# Altium project ArduinoMegaSheild.PrjPcb
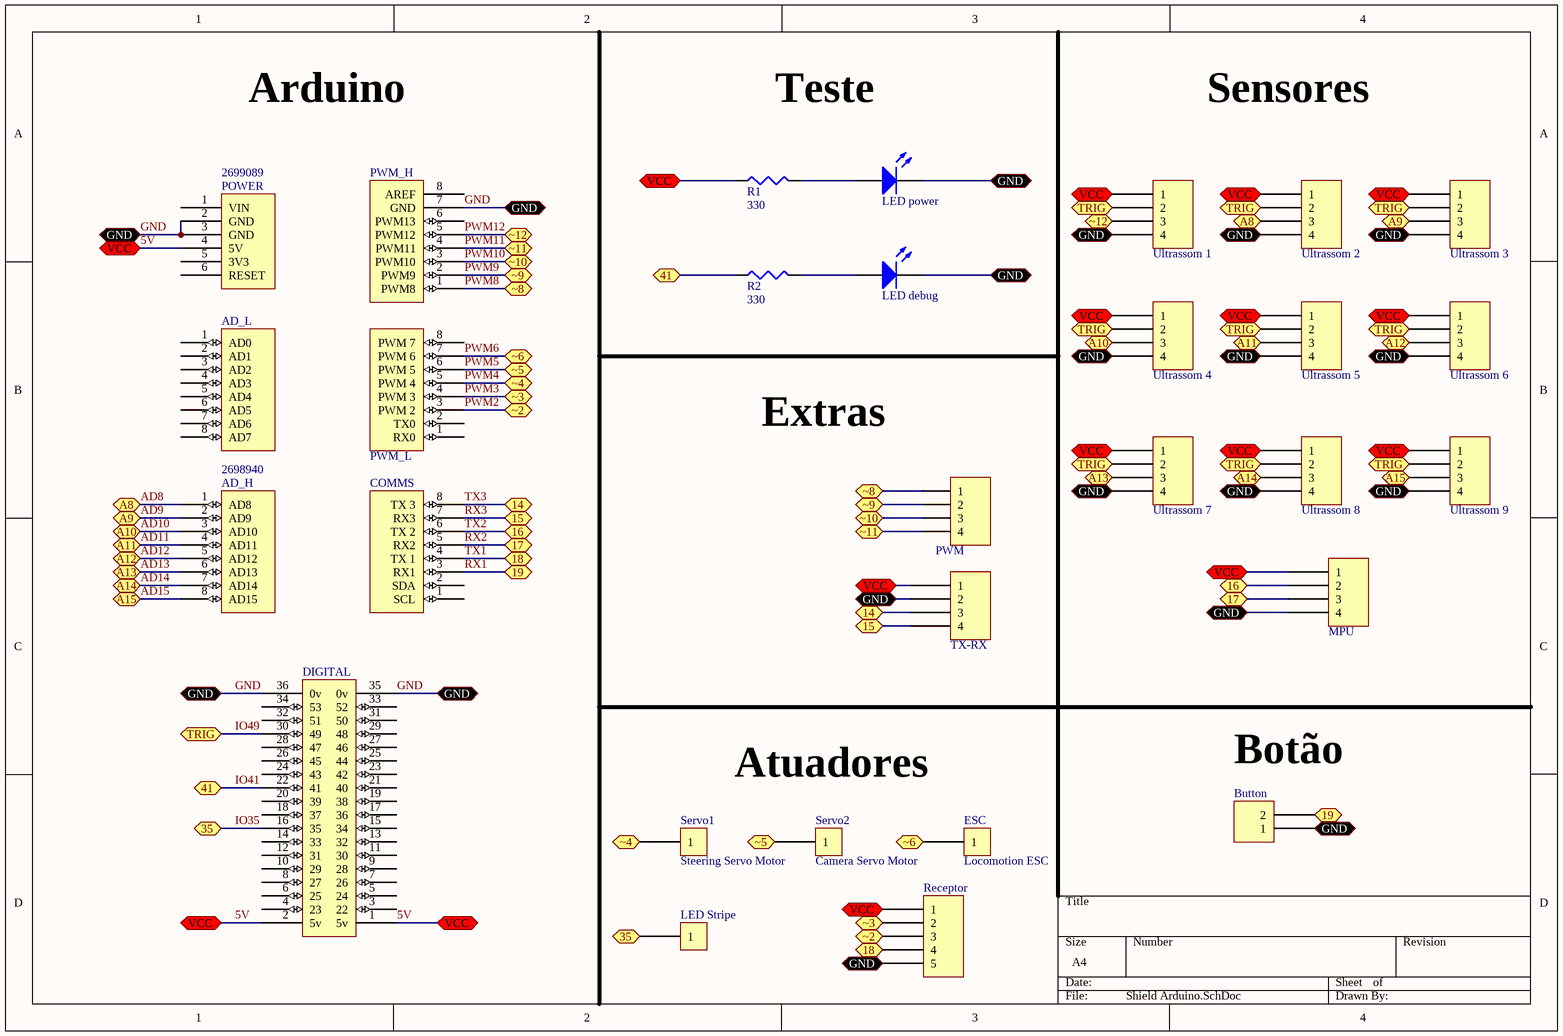
[diagram p0: Shield Arduino.SchDoc]
1 sheet, 29 parts. Net scope: flat (ports and power ports of the same name join across sheets).
Board file: Arduino MEGA blank shield.pcbdoc

## Sheet Shield Arduino.SchDoc
size A4

### Parts
AD_H  Supplier Part Number 4: 2698940  [Header 8x1 8.5mm]  (hidden comment: AD_H)
AD_L  AD_L  [Header 8x1 8.5mm]  (value not drawn)
Button  Botão  [KK2]  (value not drawn)
COMMS  Communication  [Header 8x1 8.5mm]  (value not drawn)
Debug  LED debug  [3.2X1.6X1.1]
DIGITAL  IO_36  [HEADER 36X 8MM]  (value not drawn)
ESC  Locomotion ESC  [HEADER 1X1 8.5MM]
Led1  LED power  [3.2X1.6X1.1]
LED_Stripe  *  [HEADER 1X1 8.5MM]  (value not drawn)
Motores  PWM_L  [Header 8x1 8.5mm]
MPU  MPU  [KK4]
POWER  Supplier Part Number 2: 2699089  [Header 6x1 8.5mm]  (hidden comment: POWER)
PWM  PWM  [HDR1X4]
PWM_H  PWM_H  [Header 8x1 8.5mm]  (value not drawn)
R1  R1  value 330  [J1-0603]
R2  R2  value 330  [J1-0603]
Receptor  *  (value not drawn)
Servo1  Steering Servo Motor  [HEADER 1X1 8.5MM]
Servo2  Camera Servo Motor  [HEADER 1X1 8.5MM]
TX-RX  TX-RX  [KK4]
US1  Ultrassom 1  [KK4]
US2  Ultrassom 2  [KK4]
US3  Ultrassom 3  [KK4]
US4  Ultrassom 4  [KK4]
US5  Ultrassom 5  [KK4]
US6  Ultrassom 6  [KK4]
US7  Ultrassom 7  [KK4]
US8  Ultrassom 8  [KK4]
US9  Ultrassom 9  [KK4]

### Ports
14 (bidir), 15 (bidir), 16 (bidir), 17 (bidir), 18 (bidir), 19 (bidir), 35 (bidir), 41 (bidir), A8 (bidir), A9 (bidir), A10 (bidir), A11 (bidir), A12 (bidir), A13 (bidir), A14 (bidir), A15 (bidir), GND, TRIG (bidir), VCC, ~2 (bidir), ~3 (bidir), ~4 (bidir), ~5 (bidir), ~6 (bidir), ~8 (bidir), ~9 (bidir), ~10 (bidir), ~11 (bidir), ~12 (bidir)

### Nets
5V: DIGITAL.1(5v) DIGITAL.2(5v) MPU.1 POWER.4(5V) R1.1 Receptor.1 TX-RX.1 US1.1 US2.1 US3.1 US4.1 US5.1 US6.1 US7.1 US8.1 US9.1 ; port VCC
AD8: AD_H.1(AD8) US2.3 ; port A8
AD9: AD_H.2(AD9) US3.3 ; port A9
AD10: AD_H.3(AD10) US4.3 ; port A10
AD11: AD_H.4(AD11) US5.3 ; port A11
AD12: AD_H.5(AD12) US6.3 ; port A12
AD13: AD_H.6(AD13) US7.3 ; port A13
AD14: AD_H.7(AD14) US8.3 ; port A14
AD15: AD_H.8(AD15) US9.3 ; port A15
GND: Button.1 Debug.2(K) DIGITAL.35(0v) DIGITAL.36(0v) Led1.2(K) MPU.4 POWER.2(GND) POWER.3(GND) PWM_H.7(GND) Receptor.5 TX-RX.2 US1.4 US2.4 US3.4 US4.4 US5.4 US6.4 US7.4 US8.4 US9.4 ; port GND
IO35: DIGITAL.16(35) LED_Stripe.1 ; port 35
IO41: DIGITAL.22(41) R2.1 ; port 41
IO49: DIGITAL.30(49) US1.2 US2.2 US3.2 US4.2 US5.2 US6.2 US7.2 US8.2 US9.2 ; port TRIG
PWM2: Motores.3(PWM_2) Receptor.3 ; port ~2
PWM3: Motores.4(PWM_3) Receptor.2 ; port ~3
PWM4: Motores.5(PWM_4) Servo1.1 ; port ~4
PWM5: Motores.6(PWM_5) Servo2.1 ; port ~5
PWM6: ESC.1 Motores.7(PWM_6) ; port ~6
PWM8: PWM.1 PWM_H.1(PWM8) ; port ~8
PWM9: PWM.2 PWM_H.2(PWM9) ; port ~9
PWM10: PWM.3 PWM_H.3(PWM10) ; port ~10
PWM11: PWM.4 PWM_H.4(PWM11) ; port ~11
PWM12: PWM_H.5(PWM12) US1.3 ; port ~12
RX1: Button.2 COMMS.3(RX1) ; port 19
RX2: COMMS.5(RX2) MPU.3 ; port 17
RX3: COMMS.7(RX3) TX-RX.4 ; port 15
TX1: COMMS.4(TX_1) Receptor.4 ; port 18
TX2: COMMS.6(TX_2) MPU.2 ; port 16
TX3: COMMS.8(TX_3) TX-RX.3 ; port 14
NetDebug_1: Debug.1(A) R2.2
NetLed1_1: Led1.1(A) R1.2

Not connected (* = marked no-connect by the designer): AD_L 1(AD0) 2(AD1) 3(AD2) 4(AD3) 5(AD4) 6(AD5) 7(AD6) 8(AD7); COMMS 1(SCL) 2(SDA); DIGITAL 3(22) 4(23) 5(24) 6(25) 7(26) 8(27) 9(28) 10(29) 11(30) 12(31) 13(32) 14(33) 15(34) 17(36) 18(37) 19(38) 20(39) 21(40) 23(42) 24(43) 25(44) 26(45) 27(46) 28(47) 29(48) 31(50) 32(51) 33(52) 34(53); Motores 1(RX0) 2(TX0) 8(PWM_7); POWER 1(VIN) 5(3V3) 6(RESET); PWM_H 6(PWM13) 8(AREF)

### Notes on the sheet
- Arduino
- Teste
- Sensores
- Extras
- Atuadores
- (near Button) Botão

### Library data of the parts
Button = KK2: KK Connector, 2 ways
Debug Led1 = LED2: Typical RED, GREEN, YELLOW, AMBER GaAs LED; Published: 8-Jun-2000; LatestRevisionDate: 17-Jul-2002; LatestRevisionNote: Re-released for DXP Platform.; PackageVersion: Feb-2002; PackageReference: 3.2X1.6X1.1; Publisher: Altium Limited; PackageDescription: SM LED; 2 Flat Leads
ESC LED_Stripe Servo1 Servo2 = Male Pin Head 1x1
MPU US1-US9 = KK4: KK Connector, 4 ways
PWM = Header 4: Header, 4-Pin; LatestRevisionDate: 17-Jul-2002; LatestRevisionNote: Re-released for DXP Platform.; Publisher: Altium Limited
R1 R2 = Res3: Resistor; Published: 8-Jun-2000; LatestRevisionDate: 29-May-2009; LatestRevisionNote: IPC-7351 Footprint Added.; PackageReference: J1-0603; Publisher: Altium Limited; PackageDescription: Chip Resistor
Receptor = KK5: KK Connector, 5 ways
TX-RX = Component_1: KK Connector, 4 ways
AD_H = AD_H: Supplier 1: Arrow; Supplier Part Number 1: 2698925; Supplier 2: Digi-Key; Supplier Part Number 2: SAM1198-08-ND; Supplier 3: Newark; Supplier Part Number 3: 11P8329; Supplier 4: Arrow
AD_L = AD_L: Supplier 1: Arrow; Supplier Part Number 1: 2698925; Supplier 2: Arrow; Supplier Part Number 2: 2698940; Supplier 3: Newark; Supplier Part Number 3: 11P8329; Supplier 4: Digi-Key; Supplier Part Number 4: SAM1198-08-ND
COMMS = Communication: Supplier 1: Arrow; Supplier Part Number 1: 2698925; Supplier 2: Digi-Key; Supplier Part Number 2: SAM1198-08-ND; Supplier 3: Arrow; Supplier Part Number 3: 2698940
DIGITAL = IO_36: Supplier 1: Arrow; Supplier Part Number 1: 2697470; Supplier 2: Digi-Key; Supplier Part Number 2: SAM1198-36-ND; Supplier 3: Arrow; Supplier Part Number 3: 2697486
Motores = PWM_L: Supplier 1: Arrow; Supplier Part Number 1: 2698925; Supplier 2: Arrow; Supplier Part Number 2: 2698940; Supplier 3: Digi-Key; Supplier Part Number 3: SAM1198-08-ND
POWER = POWER: Supplier 1: Arrow; Supplier Part Number 1: 2699075; Supplier 2: Arrow; Supplier 3: Newark; Supplier Part Number 3: 11P8269; Supplier 4: Digi-Key; Supplier Part Number 4: SAM1198-06-ND
PWM_H = PWM_H: Supplier 1: Arrow; Supplier Part Number 1: 2698925; Supplier 2: Arrow; Supplier Part Number 2: 2698940; Supplier 3: Digi-Key; Supplier Part Number 3: SAM1198-08-ND